# Altium schematic sheet 2_PowerSupply.SchDoc
size A4
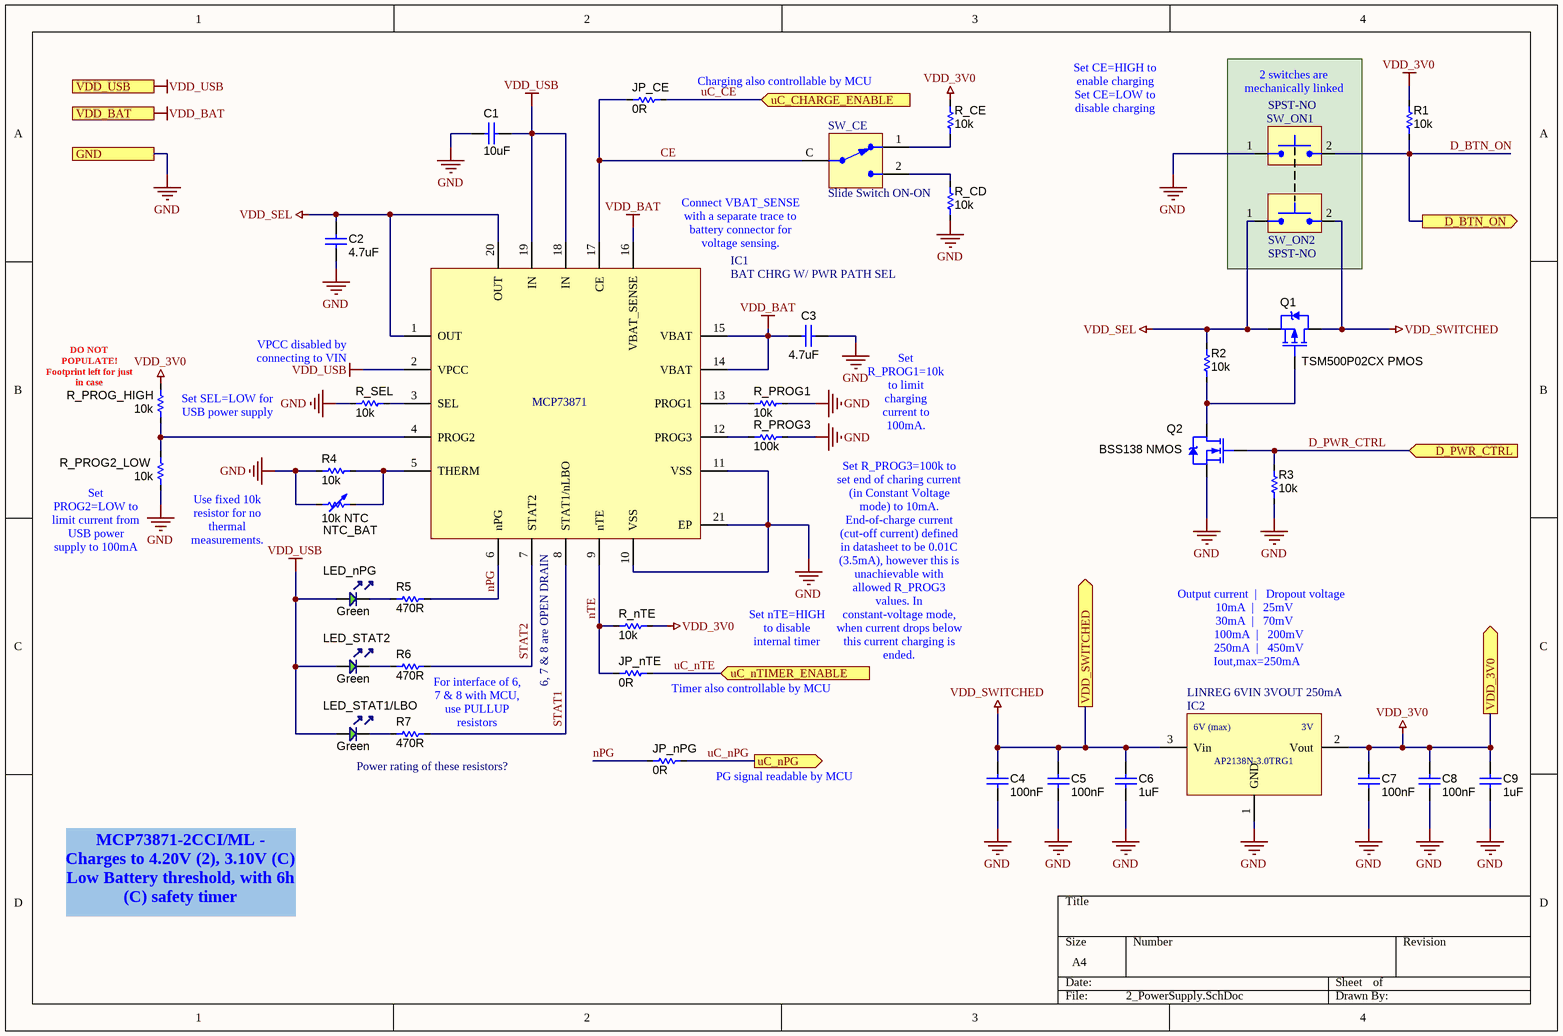
[diagram p0: 2_PowerSupply.SchDoc]

## Parts
C1  10uF  [CAP_0603]
C2  4.7uF  [CAP_0805]
C3  4.7uF  [CAP_0805]
C4  100nF  [CAP_0603]
C5  100nF  [CAP_0603]
C6  1uF  [CAP_0603]
C7  100nF  [CAP_0603]
C8  100nF  [CAP_0603]
C9  1uF  [CAP_0603]
IC1  BAT CHRG W/ PWR PATH SEL  [20-VFQFN EP (4mm x 4mm)]
IC2  LINREG 6VIN 3VOUT 250mA  [SOT-23-3]
JP_CE  0R  [RES_0603]
JP_nPG  0R  [RES_0603]
JP_nTE  0R  [RES_0603]
LED_nPG  Green  [LED_0603]
LED_STAT1/LBO  Green  [LED_0603]
LED_STAT2  Green  [LED_0603]
NTC_BAT  10k NTC  [RES VERT TH 5MM]
Q1  TSM500P02CX PMOS  [SOT-23-3]
Q2  BSS138 NMOS  [SOT-23-3]
R1  10k  [RES_0603]
R2  10k  [RES_0603]
R3  10k  [RES_0603]
R4  10k  [RES_0603]
R5  470R  [RES_0603]
R6  470R  [RES_0603]
R7  470R  [RES_0603]
R_CD  10k  [RES_0603]
R_CE  10k  [RES_0603]
R_nTE  10k  [RES_0603]
R_PROG1  10k  [RES_0603]
R_PROG2_LOW  10k  [RES_0603]
R_PROG3  100k  [RES_0603]
R_PROG_HIGH  10k  [RES_0603]
R_SEL  10k  [RES_0603]
SW_CE  Slide Switch ON-ON  [SWITCH SPDT 2.54MM R/A]
SW_ON1  SPST-NO  [SWITCH_TACTILE_SMD_6X3.5mm_2pin]
SW_ON2  SPST-NO  [SWITCH_TACTILE_SMD_6X3.5mm_2pin]

## Ports
D_BTN_ON (out), D_PWR_CTRL (in), GND, uC_CHARGE_ENABLE (in), uC_nPG (out), uC_nTIMER_ENABLE (in), VDD_3V0 (out), VDD_BAT (in), VDD_SWITCHED (out), VDD_USB (in)

## Nets
GND: C1.2 C2.2 C3.2 C4.2 C5.2 C6.2 C7.2 C8.2 C9.2 IC1.10(VSS) IC1.11(VSS) IC1.21(EP) IC2.1(GND) NTC_BAT.1 Q2.2(S) R3.1 R4.1 R_CD.1 R_PROG1.1 R_PROG2_LOW.1 R_PROG3.2 R_SEL.1 SW_ON1.1 ; port GND
VDD_3V0: C7.1 C8.1 C9.1 IC2.2(Vout) R1.2 R_CE.1 R_nTE.2 R_PROG_HIGH.2 ; port VDD_3V0
VDD_BAT: C3.1 IC1.14(VBAT) IC1.15(VBAT) IC1.16(VBAT_SENSE) ; port VDD_BAT
VDD_SEL: C2.1 IC1.1(OUT) IC1.20(OUT) Q1.2(S) R2.2 SW_ON2.1
VDD_SWITCHED: C4.1 C5.1 C6.1 IC2.3(Vin) Q1.3(D) SW_ON2.2 ; port VDD_SWITCHED
VDD_USB: C1.1 IC1.2(VPCC) IC1.18(IN) IC1.19(IN) LED_nPG.A LED_STAT1/LBO.A LED_STAT2.A ; port VDD_USB
CE: IC1.17(CE) JP_CE.1 SW_CE.C
D_BTN_ON: R1.1 SW_ON1.2 ; port D_BTN_ON
D_PWR_CTRL: Q2.1(G) R3.2 ; port D_PWR_CTRL
nPG: IC1.6(nPG) JP_nPG.2 R5.2
nTE: IC1.9(nTE) JP_nTE.2 R_nTE.1
STAT1: IC1.8(STAT1/nLBO) R7.2
STAT2: IC1.7(STAT2) R6.2
uC_CE: JP_CE.2 ; port uC_CHARGE_ENABLE
uC_nPG: JP_nPG.1 ; port uC_nPG
uC_nTE: JP_nTE.1 ; port uC_nTIMER_ENABLE
NetIC1_3: IC1.3(SEL) R_SEL.2
NetIC1_4: IC1.4(PROG2) R_PROG2_LOW.2 R_PROG_HIGH.1
NetIC1_5: IC1.5(THERM) NTC_BAT.2 R4.2
NetIC1_12: IC1.12(PROG3) R_PROG3.1
NetIC1_13: IC1.13(PROG1) R_PROG1.2
NetLED_nPG_K: LED_nPG.K R5.1
NetLED_STAT1/LBO_K: LED_STAT1/LBO.K R7.1
NetLED_STAT2_K: LED_STAT2.K R6.1
NetQ1_1: Q1.1(G) Q2.3(D) R2.1
NetR_CD_2: R_CD.2 SW_CE.2
NetR_CE_2: R_CE.2 SW_CE.1

## Notes on the sheet
- (near JP_CE) Charging also controllable by MCU
- Set CE=HIGH to enable charging
  Set CE=LOW to disable charging
- 2 switches are mechanically linked
- Connect VBAT_SENSE with a separate trace to battery connector for voltage sensing.
- (near R_PROG_HIGH) DO NOT POPULATE!
  Footprint left for just in case
- (near R_SEL) VPCC disabled by connecting to VIN
- (near R_PROG_HIGH) Set SEL=LOW for USB power supply
- Set R_PROG1=10k to limit charging current to 100mA.
- (near R_PROG2_LOW) Set PROG2=LOW to limit current from USB power supply to 100mA
- (near R_PROG2_LOW) Use fixed 10k resistor for no thermal measurements.
- Set nTE=HIGH to disable internal timer
- Set R_PROG3=100k to set end of charing current (in Constant Voltage mode) to 10mA. End-of-charge current (cut-off current) defined in datasheet to be 0.01C (3.5mA), however this is unachievable with allowed R_PROG3 values. In constant-voltage mode, when current drops below this current charging is ended.
- (near IC1) 6, 7 & 8 are OPEN DRAIN
- (near JP_nTE) Timer also controllable by MCU
- Output current  |   Dropout voltage
  10mA  |   25mV
  30mA  |   70mV
  100mA  |   200mV
  250mA  |   450mV
  Iout,max=250mA
- Power rating of these resistors?
- For interface of 6, 7 & 8 with MCU, use PULLUP resistors
- (near JP_nPG) PG signal readable by MCU
- MCP73871-2CCI/ML - Charges to 4.20V (2), 3.10V (C) Low Battery threshold, with 6h (C) safety timer
- (in symbol IC_BATCHRG_PWRPATH_MCP73871) MCP73871
- (in symbol IC_LINREG_6V_3V_250mA_SOT23-3) 3V

## Library data of the parts
C1 = CAP_10uF_16V_0603: Cermacic Capacitor 0603 16V 10uF; Manufacturer: n/a; Manufacturer Part Number: n/a; Supplier: Kelco; Supplier Part Number: 20214; Package: 0603; Capacitance: 10uF; Voltage Rating: 16V; Tolerance: n/a; Dielectric class: n/a
C2 C3 = CAP_4.7uF_25V_0805: Cermacic Capacitor 0805 25V 4.7uF; Manufacturer: n/a; Manufacturer Part Number: n/a; Supplier: Kelco; Supplier Part Number: 20226; Package: 0805; Capacitance: 4.7uF; Voltage Rating: 25v; Tolerance: n/a; Dielectric class: n/a
C4 C5 C7 C8 = CAP_100nF_50V_0603: Cermacic Capacitor 0603 50V 100nF; Dielectric class: X7R; Manufacturer: n/a; Manufacturer Part Number: n/a; Supplier: Kelco; Supplier Part Number: 11061; Package: 0603; Capacitance: 100nF; Voltage Rating: 50V; Tolerance: n/a
C6 C9 = CAP_1uF_16V_0603: Cermacic Capacitor 0603 16V 1uF; Dielectric class: Y5V; Manufacturer: n/a; Manufacturer Part Number: n/a; Supplier: Kelco; Supplier Part Number: 12930; Package: 0603; Capacitance: 1uF; Voltage Rating: 16V; Tolerance: n/a
IC1 = IC_BATCHRG_PWRPATH_MCP73871: Stand-Alone System Load Sharing and Li-Ion/Li-Polymer Battery Charge Management Controller / Battery charger with power path selection; Manufacturer: Microchip; Manufacturer Part Number: MCP73871-2CCI/ML; Supply Voltage: 4.2V (battery), 6V (USB); Quiescent Current: 180uA; Supplier: Digikey; Supplier Part Number: MCP73871-2CCI/ML-ND; Package: 20-VFQFN Exposed Pad; Value: BAT CHRG W/ PWR PATH SEL; Operating Temperature: -40°C ~ +85°C
IC2 = IC_LINREG_6V_3V_250mA_SOT23-3: IC Linear Regulator Fixed 3V 250mA 6Vinmax SOT-23-3; Manufacturer: Diodes Incorporated; Manufacturer Part Number: AP2138N-3.0TRG1; Supply Voltage: 6V (max); Quiescent Current: 1uA; Supplier: DigiKey; Supplier Part Number: AP2138N-3.0TRG1DICT-ND; Package: SOT-23-3; Value: LINREG 6VIN 3VOUT 250mA; Operating Temperature: -40°C ~ 85°C; ComponentLink1Description: Datasheet; ComponentLink1URL: https://www.diodes.com/assets/Datasheets/AP2138-9.pdf
JP_CE JP_nPG JP_nTE = RES_0R_1%_0.1W_0603: Resistor SMD 0603 0R 0.1W 1%; Manufacturer: n/a; Manufacturer Part Number: n/a; Supplier: Kelco; Supplier Part Number: 13738; Resistance: 0R; Package: 0603; Power Rating: 0.1W; Tolerance: 1%
LED_nPG LED_STAT1/LBO LED_STAT2 = LED_Green_3V_20mA_0603: LED Diode SMD Green; Forward Voltage: 3V; Forward Current: 20mA; Intensity: 120mCd; Angle of Visibility: 120deg; Manufacturer: n/a; Manufacturer Part Number: n/a; Supplier: Kelco; Supplier Part Number: 18013; Color: Green; Package: 0603
NTC_BAT = THERM_NTC_10k_10%_0.25W_TH: Thermistor NTC though-hole 10k @ 25degC 1/4W 10%; Power Rating: 0.25W; Manufacturer: n/a; Manufacturer Part Number: n/a; Supplier: Kelco; Supplier Part Number: 4450; Resistance: 10k NTC; Package: TH; Tolerance: 10%; ComponentLink1Description: Datasheet; ComponentLink1URL: https://www.tdk-electronics.tdk.com/inf/50/db/ntc/NTC_Leaded_disks_K164.pdf
Q1 = MOSFET_P_20V_4.7A_TSM500P02CX_SOT-23: MOSFET P-channel SMD TSM500P02CX; Manufacturer: Taiwan Semiconductor; VGSmax: 10V; VDSmax: 20V; IDmax: 4.7A; IDmax (pulse): 18.8A; RDSon: 57mOhm; Transconductance gfs: 7S; PDmax: 1.56W; Vth: 0.6V; Manufacturer Part Number: TSM500P02CX; Supplier: Kelco; Supplier Part Number: 18879; Value: TSM500P02CX PMOS; Package: SOT-23-3; ComponentLink1Description: Datasheet; ComponentLink1URL: https://www.taiwansemi.com/assets/uploads/datasheet/TSM500P02CX_B1811.pdf
Q2 = MOSFET_N_60V_220mA_BSS138_SOT-23: MOSFET N-channel SMD BSS138 220mA 50V; Manufacturer: ONsemi; VGSmax: 20V; VDSmax: 60V; IDmax (pulse): 880mA; RDSon: 1Ohm; Transconductance gfs: 0.5S; PDmax: 0.35W; Vth: 1.3V; Manufacturer Part Number: BSS138; Supplier: Kelco; Supplier Part Number: 19727; Value: BSS138 NMOS; Package: SOT-23-3; IDmax: 220mA; ComponentLink1Description: Datasheet; ComponentLink1URL: https://www.onsemi.com/pdf/datasheet/nds7002a-d.pdf
R1-R4 R_CD R_CE R_nTE R_PROG1 R_PROG2_LOW R_PROG_HIGH R_SEL = RES_10k_1%_0.1W_0603: Resistor SMD 0603 10k 0.1W 1%; Manufacturer: n/a; Manufacturer Part Number: n/a; Supplier: Kelco; Supplier Part Number: 11702; Resistance: 10k; Package: 0603; Power Rating: 0.1W; Tolerance: 1%
R5-R7 = RES_470R_1%_0.1W_0603: Resistor SMD 0603 0R 0.1W 1%; Manufacturer: n/a; Manufacturer Part Number: n/a; Supplier: Kelco; Supplier Part Number: 8983; Resistance: 470R; Package: 0603; Power Rating: 0.1W; Tolerance: 1%
R_PROG3 = RES_100k_1%_0.1W_0603: Resistor SMD 0603 100k 0.1W 1%; Manufacturer: n/a; Manufacturer Part Number: n/a; Supplier: Kelco; Supplier Part Number: 11704; Resistance: 100k; Package: 0603; Power Rating: 0.1W; Tolerance: 1%
SW_CE = SWITCH_SLIDE_SPDT_ESP201_R/A_2.54mm: Slide switch 2.54mm pitch Single Pole Double Throw (ON-ON) ESP201 Right Angle; Manufacturer: ECE; Rated Voltage: 12VDC; Rated Current: 500mA; Contact Configuration: SPDT; Manufacturer Part Number: ESP201; Supplier: Kelco; Supplier Part Number: 14323; Value: Slide Switch ON-ON; Pitch: 2.54mm; Orientation: Right Angle
SW_ON1 SW_ON2 = SWITCH_SMD_6X3.5mm_2pin: SMD Tactile switch 2 pin 6x3.5mm SPST-NO 5mm height; Manufacturer: Diptronics; Manufacturer Part Number: DTSM-32N; Rated Voltage: 12V; Rated Current: 50mA; Contact Resistance: 100mOhm; Supplier: Kelco; Supplier Part Number: 15159; Contact form: SPST-NO; ComponentLink1Description: Datasheet; ComponentLink1URL: https://eu.mouser.com/datasheet/2/910/444_DTS-3-1571561.pdf